# EAGLE design audio-only-circuit (EAGLE 9.2.2)
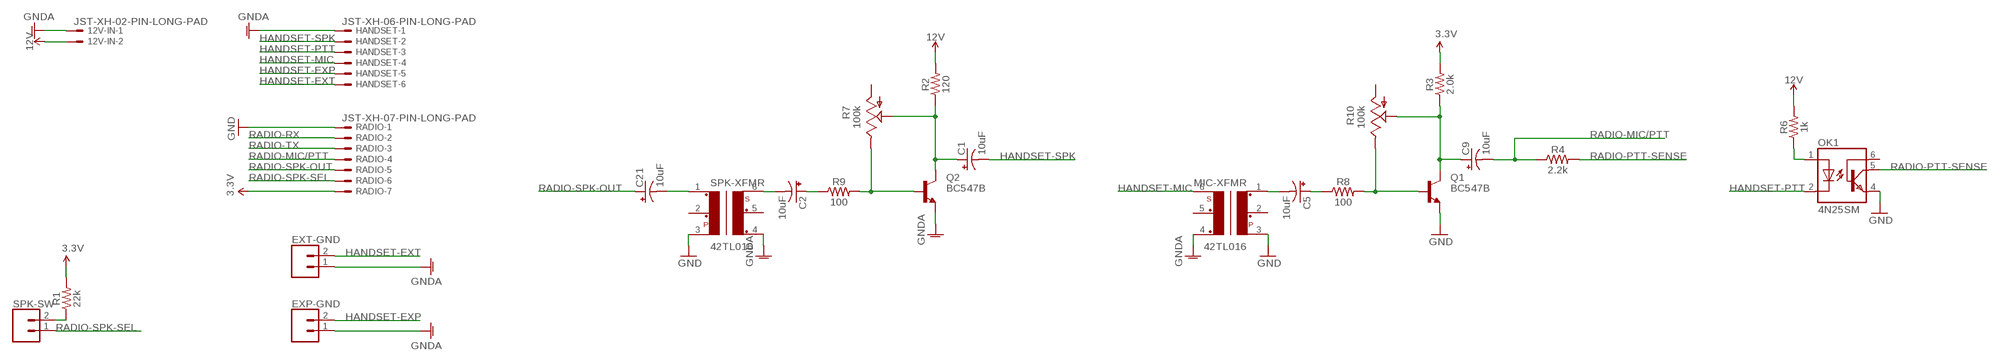
[diagram p0: schematic, sheet 1]

## Parts
12V-IN  JST-XH-02-PIN-LONG-PAD  [JST-XH-02-PACKAGE-LONG-PAD]
C1  10uF  CPOL-USE2.5-5  [E2,5-5]
C2  10uF  CPOL-USE2.5-5  [E2,5-5]
C5  10uF  CPOL-USE2.5-5  [E2,5-5]
C9  10uF  CPOL-USE2.5-5  [E2,5-5]
C21  10uF  CPOL-USE2.5-5  [E2,5-5]
EXP-GND  CONN_02  [1X02]
EXT-GND  CONN_02  [1X02]
HANDSET  JST-XH-06-PIN-LONG-PAD  [JST-XH-06-PACKAGE-LONG-PAD]
MIC-XFMR  42TL016  [42TL]
OK1  4N25SM  [DIL6-SMD]
Q1  BC547B  [TO92]
Q2  BC547B  [TO92]
R1  22k  22KOHM-0603-1/10W-1%  [0603]
R2  120  RESISTOR0603  [0603]
R3  2.0k  2.0KOHM-0603-1/10W-5%  [0603]
R4  2.2k  2.2KOHM-0603-1/10W-1%  [0603]
R6  1k  1KOHM-0603-1/10W-1%  [0603]
R7  100k  TRIM_US-S64W  [S64W]
R8  100  100OHM-0603-1/4W-5%  [0603]
R9  100  100OHM-0603-1/4W-5%  [0603]
R10  100k  TRIM_US-S64W  [S64W]
RADIO  JST-XH-07-PIN-LONG-PAD  [JST-XH-07-PACKAGE-LONG-PAD]
SPK-SW  CONN_02  [1X02]
SPK-XFMR  42TL016  [42TL]

## Nets
3.3V: R1.2 R3.2 RADIO.7
12V: 12V-IN.2 R2.2 R6.2
GND: MIC-XFMR.3 OK1.4(EMI) Q1.1(E) RADIO.1 SPK-XFMR.3
GNDA: 12V-IN.1 EXP-GND.1 EXT-GND.1 HANDSET.1 MIC-XFMR.4 Q2.1(E) SPK-XFMR.4
HANDSET-EXP: EXP-GND.2 HANDSET.5
HANDSET-EXT: EXT-GND.2 HANDSET.6
HANDSET-MIC: HANDSET.4 MIC-XFMR.6
HANDSET-PTT: HANDSET.3 OK1.2(C)
HANDSET-SPK: C1.- HANDSET.2
N$2: C2.- SPK-XFMR.6
N$3: C9.+ Q1.3(C) R3.1 R10.S
N$4: Q1.2(B) R8.2 R10.E
N$5: Q2.2(B) R7.E R9.2
N$6: C21.- SPK-XFMR.1
N$7: C5.- MIC-XFMR.1
N$8: C5.+ R8.1
N$9: OK1.1(A) R6.1
N$10: C2.+ R9.1
N$12: R1.1 SPK-SW.2
RADIO-MIC/PTT: C9.- R4.1 RADIO.4
RADIO-PTT-SENSE: OK1.5(COL) R4.2
RADIO-RX: RADIO.2
RADIO-SPK-OUT: C21.+ RADIO.5
RADIO-SPK-SEL: RADIO.6 SPK-SW.1
RADIO-TX: RADIO.3
SPKAMP: C1.+ Q2.3(C) R2.1 R7.S
Unconnected: MIC-XFMR.2 MIC-XFMR.5 OK1.6(BAS) R7.A R10.A SPK-XFMR.2 SPK-XFMR.5

## Library data of the parts
12V-IN = Rembrandt Electronics - JST XH Connectors v1-0:JST-XH-02-PIN: JST XH Connector 2 Pin Wire to board connector. Pitch: 2,54 mm, (0.100") Number of pins: 2 Created by Rembrandt Electronics www.rembrandtelectronics.com
C1 C2 C5 C9 C21 = adafruit:CPOL-US: POLARIZED CAPACITOR, American symbol
EXP-GND EXT-GND SPK-SW = SparkFun-Connectors:CONN_02: Multi connection point. Often used as Generic Header-pin footprint for 0.1 inch spaced/style header connections On any of the 0.1 inch spaced packages, you can populate with these: Break Away Headers - Straight <https://www.sparkfun.com/products/116> (PRT-00116) Break Away Male Headers - Right Angle <https://www.sparkfun.com/products/553> (PRT-00553) Female Headers <https://www.sparkfun.com/products/115> (PRT-00115) Break Away Headers - Machine Pin <https://www.sparkfun.com/products/117> (PRT-00117) Break Away Female Headers - Swiss Machine Pin <https://www.sparkfun.com/products/743> (PRT-00743) For SCREWTERMINALS and SPRING TERMINALS visit here: Screw Terimnals on SparkFun.com <https://www.sparkfun.com/search/results?term=Screw+Terminals> (5mm/3.5mm/2.54mm spacing) This device is also useful as a general connection point to wire up your design to another part of your project. Our various solder wires solder well into these plated through hole pads. Hook-Up Wire - Assortment (Stranded, 22 AWG) <https://www.sparkfun.com/products/11375> (PRT-11375) Hook-Up Wire - Assortment (Solid Core, 22 AWG) <https://www.sparkfun.com/products/11367> (PRT-11367) View the entire wire category on our website here <https://www.sparkfun.com/categories/141> Special notes: Molex polarized connector foot print use with: PRT-08233 with associated crimp pins and housings. 2.54_SCREWTERM for use with PRT-10571. 3.5mm Screw Terminal footprints for PRT-08084 5mm Screw Terminal footprints for use with PRT-08432
HANDSET = Rembrandt Electronics - JST XH Connectors v1-0:JST-XH-06-PIN: JST XH Connector 2 Pin Wire to board connector. Pitch: 2,54 mm, (0.100") Number of pins: 6 Created by Rembrandt Electronics www.rembrandtelectronics.com
MIC-XFMR SPK-XFMR = trafo-xicon:42T?*: Xicon Micro-Mini EI-12 Audio Transformers 42TL/42TC/42TM Series Source: http://www.mouser.com//catalog/specsheets/164201.pdf http://www.mouser.com/catalog/specsheets/114225.pdf http://www.mouser.com/catalog/specsheets/164267.pdf; OC_FARNELL: unknown; OC_NEWARK: unknown
OK1 = optocoupler:4N*?M: General Purpose 6-Pin Phototransistor Optocouplers Source: http://www.fairchildsemi.com/ds/4N/4N35-M.pdf; MF: FAIRCHILD SEMICONDUCTOR; MPN: 4N25SM; OC_FARNELL: 1021152; OC_NEWARK: 34C2020
Q1 Q2 = transistor-npn:BC547*: NPN Transistor
R1 = SparkFun-Resistors:22KOHM: 22kΩ resistor A resistor is a passive two-terminal electrical component that implements electrical resistance as a circuit element. Resistors act to reduce current flow, and, at the same time, act to lower voltage levels within circuits. - Wikipedia; PROD_ID: RES-07853
R2 = SparkFun-Resistors:RESISTOR: Generic Resistor Package
R3 = SparkFun-Resistors:2.0KOHM: 2kΩ resistor A resistor is a passive two-terminal electrical component that implements electrical resistance as a circuit element. Resistors act to reduce current flow, and, at the same time, act to lower voltage levels within circuits. - Wikipedia; PROD_ID: RES-08296
R4 = SparkFun-Resistors:2.2KOHM: 2.2kΩ resistor A resistor is a passive two-terminal electrical component that implements electrical resistance as a circuit element. Resistors act to reduce current flow, and, at the same time, act to lower voltage levels within circuits. - Wikipedia; PROD_ID: RES-08272
R6 = SparkFun-Resistors:1KOHM: 1kΩ resistor A resistor is a passive two-terminal electrical component that implements electrical resistance as a circuit element. Resistors act to reduce current flow, and, at the same time, act to lower voltage levels within circuits. - Wikipedia; PROD_ID: RES-07856
R7 R10 = pot:TRIM_US-: POTENTIOMETER
R8 R9 = SparkFun-Resistors:100OHM: 100Ω resistor A resistor is a passive two-terminal electrical component that implements electrical resistance as a circuit element. Resistors act to reduce current flow, and, at the same time, act to lower voltage levels within circuits. - Wikipedia; PROD_ID: RES-12438
RADIO = Rembrandt Electronics - JST XH Connectors v1-0:JST-XH-07-PIN: JST XH Connector 2 Pin Wire to board connector. Pitch: 2,54 mm, (0.100") Number of pins: 7 Created by Rembrandt Electronics www.rembrandtelectronics.com

## Board
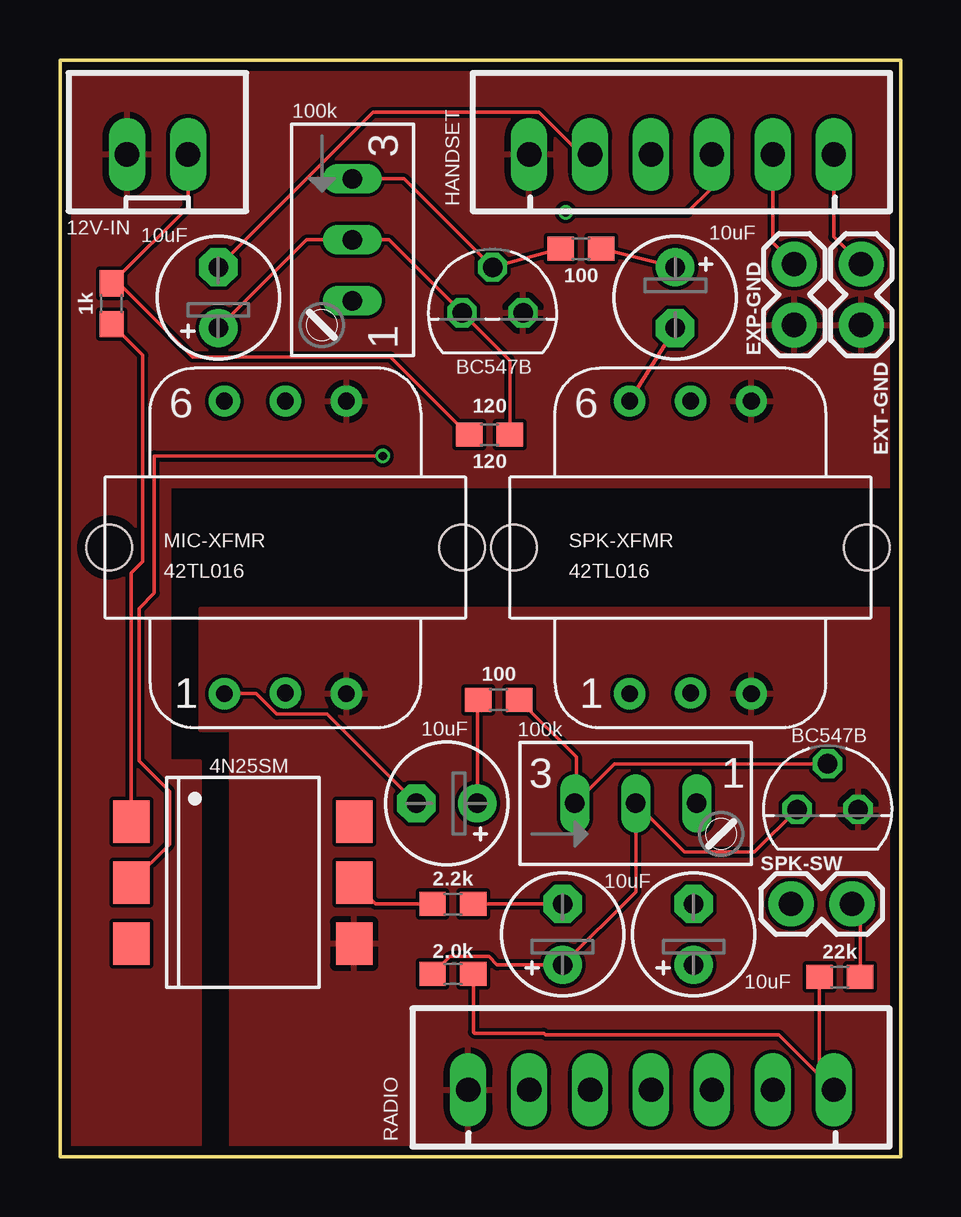
[diagram p1: board, top side]
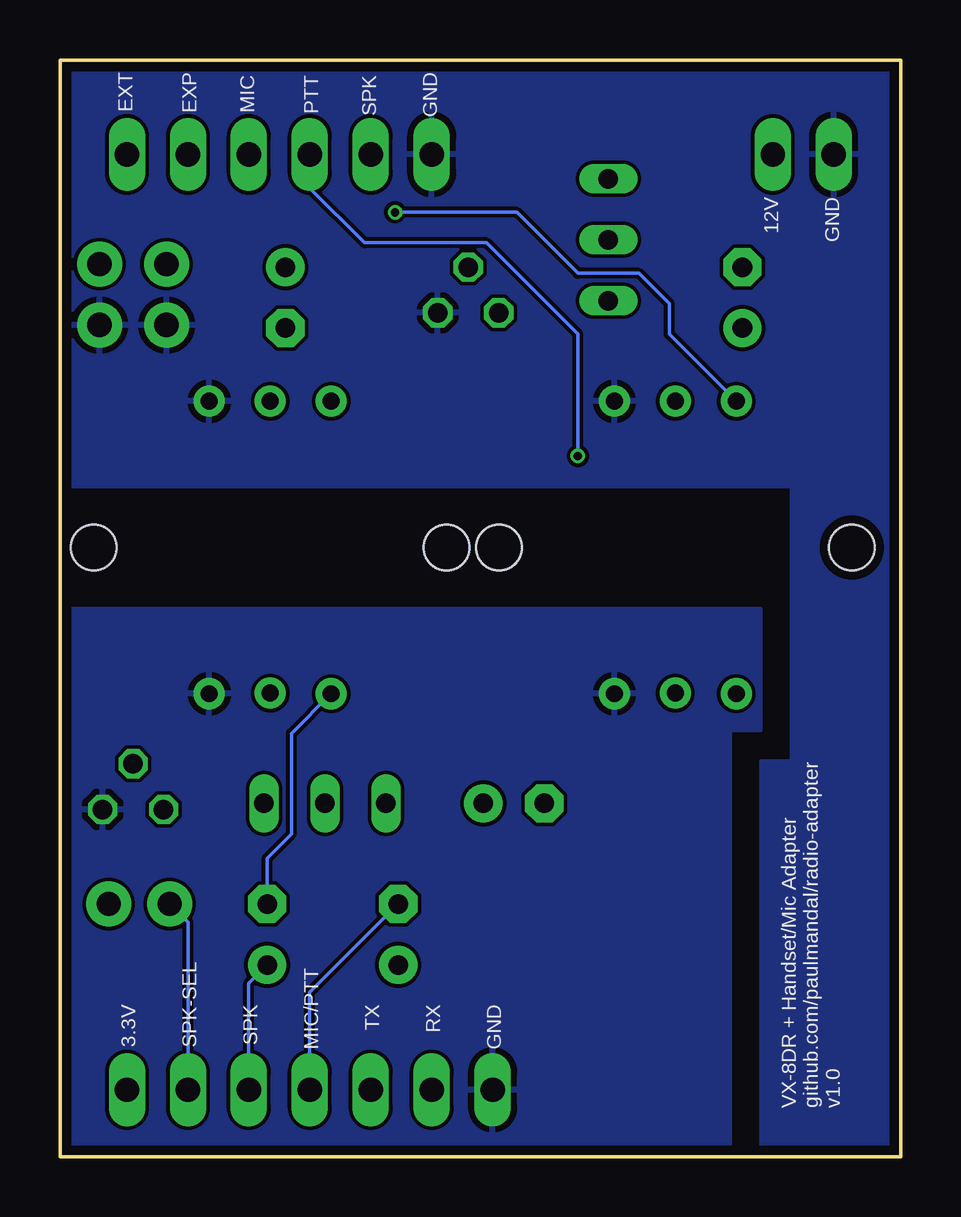
[diagram p2: board, bottom side, seen from below]

Size 35.05 x 45.72 mm. Coordinates in mm from the lower left corner, seen from the top.
Outline: 0,0 35.05,0 35.05,45.72 0,45.72 0,0
Copper layers (1*16): Top 0.035559375mm / dielectric 1.6mm / Bottom 0.035559375mm
Design rules "oshpark-2layer": minimum track width 6mil, minimum drill 10mil, track to track 6mil, track to pad 6mil, pad to pad 6mil, via to via 6mil, smd to smd 6mil, copper to edge 15mil, drill to drill 6mil, minimum pad ring 5mil, minimum via ring 5mil, stop-mask expansion 2.5mil, vias tented up to drill 0mil, thermal gap 10mil

### Footprints (pad centres in the part's own frame; a part is rotated, then mirrored left to right if it is on the bottom)
JST-XH-02-PACKAGE-LONG-PAD = drill 1.016 long: 1 -1.27,0; 2 1.27,0
E2,5-5 = drill 0.813 pad 1.6: + -1.27,0 | drill 0.813 pad 1.6 octagon: - 1.27,0
1X02 = drill 1.016 pad 1.88: 1 0,0; 2 2.54,0
JST-XH-06-PACKAGE-LONG-PAD = drill 1.016 long: 1 -6.35,0; 2 -3.81,0; 3 -1.27,0; 4 1.27,0; 5 3.81,0; 6 6.35,0
42TL = drill 0.7 pad 1.3: 1 -2.54,-6.096; 2 0,-6.068; 3 2.54,-6.096; 4 2.54,6.096; 5 0,6.096; 6 -2.54,6.096 | hole 1.9: -7.353,0; 7.353,0
DIL6-SMD = smd 1.78 x 1.52: 1 -2.54,-4.645; 2 0,-4.645; 3 2.54,-4.645; 4 2.54,4.645; 5 0,4.645; 6 -2.54,4.645
TO92 = drill 0.813 octagon: 1 1.27,0; 2 0,1.905; 3 -1.27,0
0603 = smd 1.1 x 1: 1 -0.85,0; 2 0.85,0
S64W = drill 0.813 long: A 2.54,1.27; E -2.54,1.27; S 0,1.27
JST-XH-07-PACKAGE-LONG-PAD = drill 1.016 long: 1 -7.62,0; 2 -5.08,0; 3 -2.54,0; 4 0,0; 5 2.54,0; 6 5.08,0; 7 7.62,0

### Placement (x,y rotation side)
12V-IN  4.06,41.78 0 top
C1  6.6,35.81 90 top
C2  25.65,35.81 270 top
C5  16.13,14.73 180 top
C9  20.96,9.27 90 top
C21  26.42,9.27 90 top
EXP-GND  30.61,34.67 90 top
EXT-GND  33.4,34.67 90 top
HANDSET  25.91,41.78 0 top
MIC-XFMR  9.4,25.4 0 top
OK1  7.62,11.43 270 top
Q1  32,14.48 0 top
Q2  18.03,35.18 0 top
R1  32.51,7.49 180 top
R2  17.91,30.1 180 top
R3  16.38,7.62 0 top
R4  16.38,10.54 180 top
R6  2.16,35.56 90 top
R7  10.92,38.23 270 top
R8  18.29,19.05 0 top
R9  21.72,37.85 180 top
R10  24,13.46 0 top
RADIO  24.64,2.79 0 top
SPK-SW  30.48,10.54 0 top
SPK-XFMR  26.29,25.4 0 top

### Tracks (layer width: path | path; a pad name or v marks a point on that pad's centre or on a via)
3.3V
  Top 0.152: R1.2 31.66,3.39 RADIO.7 29.97,5.08 20.24,5.08 20.17,5.16 17.27,5.16 17.23,5.2 R3.2
12V
  Top 0.152: R2.2 16.64,30.48 13.78,33.34 5.53,33.34 2.31,36.56 | 2.31,36.56 5.33,39.59 12V-IN.2 | 2.31,36.56 R6.2
GND
  pour Top: 7.11,0 7.11,17.78 5.84,17.78 5.84,22.86 35.05,22.86 35.05,0
  pour Bottom: 7.11,0 7.11,17.78 5.84,17.78 5.84,20.32 5.84,22.86 35.05,22.86 35.05,0
GNDA
  pour Top: 5.84,0 0,0 0,45.72 35.05,45.72 35.05,27.94 4.57,27.94 4.57,16.51 5.84,16.51
  pour Bottom: 5.84,0 5.84,16.51 4.57,16.51 4.57,27.94 35.05,27.94 35.05,45.72 0,45.72 0,0
HANDSET-EXP
  Top 0.152: HANDSET.5 29.72,38.1 EXP-GND.2
HANDSET-EXT
  Top 0.152: HANDSET.6 32.26,38.35 EXT-GND.2
HANDSET-MIC  (via drill 0.35)
  Top 0.152: v21.08,39.37 26.16,39.37 27.18,40.39 HANDSET.4
  Bottom 0.152: MIC-XFMR.6 9.65,34.29 9.65,35.56 10.92,36.83 13.46,36.83 16,39.37 v21.08,39.37
HANDSET-PTT  (via drill 0.35)
  Top 0.152: OK1.2 4.57,13.03 4.57,15.24 3.3,16.51 3.3,22.86 3.94,23.5 3.94,29.21 v13.46,29.21
  Bottom 0.152: v13.46,29.21 13.46,34.29 17.27,38.1 22.35,38.1 24.64,40.39 HANDSET.3
HANDSET-SPK
  Top 0.152: HANDSET.2 21.72,41.78 19.97,43.54 13.06,43.54 C1.-
N$2
  Top 0.152: SPK-XFMR.6 C2.-
N$3
  Top 0.152: R3.1 16.26,8.35 17.88,8.35 18.23,8 C9.+ 24,11.05 R10.S 26.04,12.7 28.96,12.7 Q1.3
N$4
  Top 0.152: Q1.2 23.11,16.38 21.53,14.8 | 21.53,14.8 R10.E | R8.2 21.53,16.66 21.53,14.8
N$5
  Top 0.152: R7.E 14.35,40.77 Q2.2 R9.2
N$6
  Bottom 0.152: C21.- 26.42,12.45 25.4,13.46 25.4,17.65 SPK-XFMR.1
N$7
  Top 0.152: MIC-XFMR.1 8.18,19.3 9.03,18.45 11.14,18.45 C5.-
N$8
  Top 0.152: C5.+ 17.4,19.01 R8.1
N$9
  Top 0.152: OK1.1 2.97,24.34 3.45,24.82 3.45,33.42 R6.1
N$10
  Top 0.152: R9.1 C2.+
N$12
  Top 0.152: R1.1 33.36,10.2 SPK-SW.2
RADIO-MIC/PTT
  Top 0.152: R4.1 C9.-
  Bottom 0.152: RADIO.4 24.64,6.86 C9.-
RADIO-PTT-SENSE
  Top 0.152: OK1.5 13.15,10.54 R4.2
RADIO-SPK-OUT
  Bottom 0.152: RADIO.5 27.18,7.24 C21.+
RADIO-SPK-SEL
  Bottom 0.152: RADIO.6 29.72,9.78 SPK-SW.1
SPKAMP
  Top 0.152: R2.1 18.76,33.19 Q2.3 13.72,38.23 R7.S 10.29,38.23 C1.+

### Text on the board
bPlace: GND | SPK | PTT | MIC | EXP | EXT | GND | 12V | MIC/PTT | SPK-SEL | GND | RX | TX | SPK | 3.3V | VX-8DR + Handset/Mic Adapter / github.com/paulmandal/radio-adapter / v1.0
tNames: 120